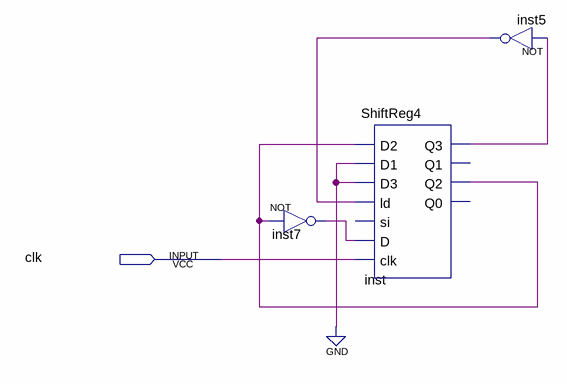
[diagram p0: schematic sheet]
// Quartus schematic Block1.bdf as structural Verilog: 3 symbols, 1 pins
module Block1 (
  input  clk
);

  wire inst5_out, inst7_out, inst_q2, inst_q3;

  not inst7 (inst7_out, inst_q2);
  ShiftReg4 inst (
    .D2(inst_q2), .D1(1'b0), .D3(1'b0), .ld(inst5_out), .D(inst7_out), .clk(clk), .Q3(inst_q3), .Q2(inst_q2));  // open: si, Q1, Q0
  not inst5 (inst5_out, inst_q3);
endmodule
